# EAGLE design lab2sch (EAGLE 9.6.2)
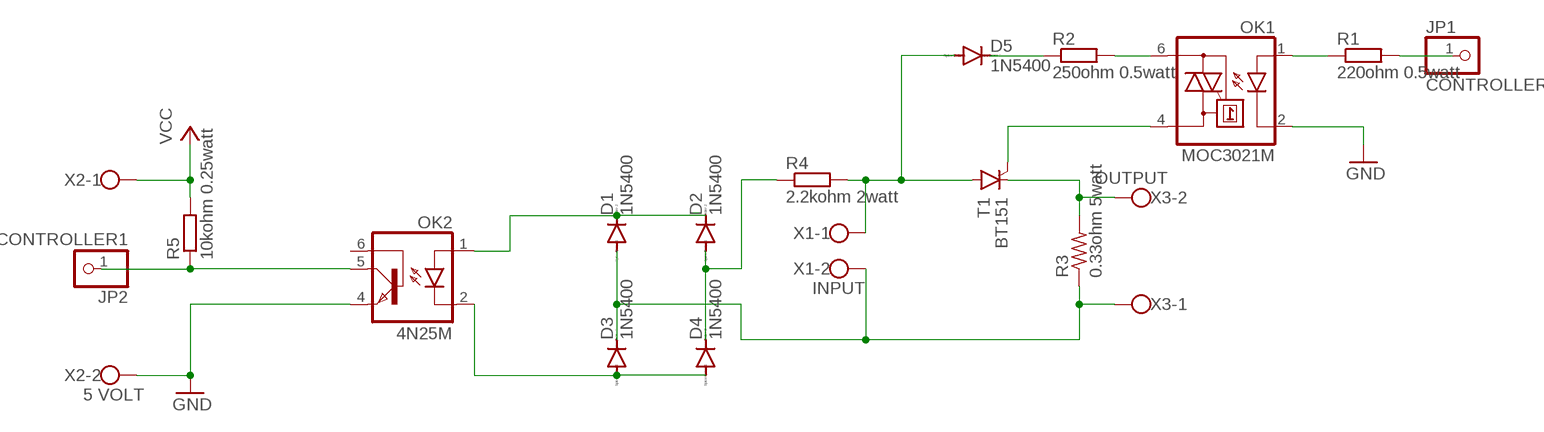
[diagram p0: schematic, sheet 1]

## Parts
D1  1N5400  [DO201-15]
D2  1N5400  [DO201-15]
D3  1N5400  [DO201-15]
D4  1N5400  [DO201-15]
D5  1N5400  [DO201-15]
JP1  CONTROLLER  PINHD-1X1  [1X01]
JP2  CONTROLLER1  PINHD-1X1  [1X01]
OK1  MOC3021M  [DIL06]
OK2  4N25M  [DIL06]
R1  220ohm 0.5watt  R-EU_0204/7  [0204/7]
R2  250ohm 0.5watt  R-EU_0204/7  [0204/7]
R3  0.33ohm 5watt  R-US_0617/22  [0617/22]
R4  2.2kohm 2watt  R-EU_0204/7  [0204/7]
R5  10kohm 0.25watt  R-EU_0204/7  [0204/7]
T1  BT151  [TO220CL]
X1  INPUT  W237-102  [W237-102]
X2  5 VOLT  W237-102  [W237-102]
X3  OUTPUT  W237-102  [W237-102]

## Nets
GND: OK1.2(C) OK2.4(EMI) X2.2
N$1: OK1.1(A) R1.1
N$2: OK1.6(A2) R2.2
N$3: D5.C R2.1
N$4: OK1.4(A1) T1.G
N$5: R3.2 T1.C X3.2
N$6: D5.A R4.2 T1.A X1.1
N$7: D1.C D2.C OK2.1(A)
N$8: D1.A D3.C R3.1 X1.2 X3.1
N$9: D2.A D4.C R4.1
N$10: D3.A D4.A OK2.2(C)
N$11: JP1.1 R1.2
N$13: JP2.1 OK2.5(COL) R5.1
VCC: R5.2 X2.1
Unconnected: OK2.6(BAS)

## Library data of the parts
D1-D5 = diode:1N5400: DIODE standard rectifier, 3 A, 50 V (Motorola)
JP1 JP2 = pinhead:PINHD-1X1: PIN HEADER
OK1 = optocoupler:MOC30*M: RANDOM-PHASE OPTOISOLATORS TRIAC DRIVER OUTPUT Source: http://www.fairchildsemi.com MOC3020-M.pdf; MF: FAIRCHILD SEMICONDUCTOR; MPN: MOC3021-M; OC_FARNELL: 1021365; OC_NEWARK: 95B7895
OK2 = optocoupler:4N*?M: General Purpose 6-Pin Phototransistor Optocouplers Source: http://www.fairchildsemi.com/ds/4N/4N35-M.pdf; MPN: 4N25-M; OC_FARNELL: 1021349; OC_NEWARK: 98K9084
R1 R2 R4 R5 = rcl:R-EU_: RESISTOR, European symbol; SPICEPREFIX: R
R3 = rcl:R-US_: RESISTOR, American symbol; SPICEPREFIX: R
T1 = triac:BT151: THYRISTOR
X1-X3 = con-wago-500:W237-102: WAGO SCREW CLAMP; MPN: 237-102; OC_FARNELL: unknown; OC_NEWARK: 70K9898

## Board
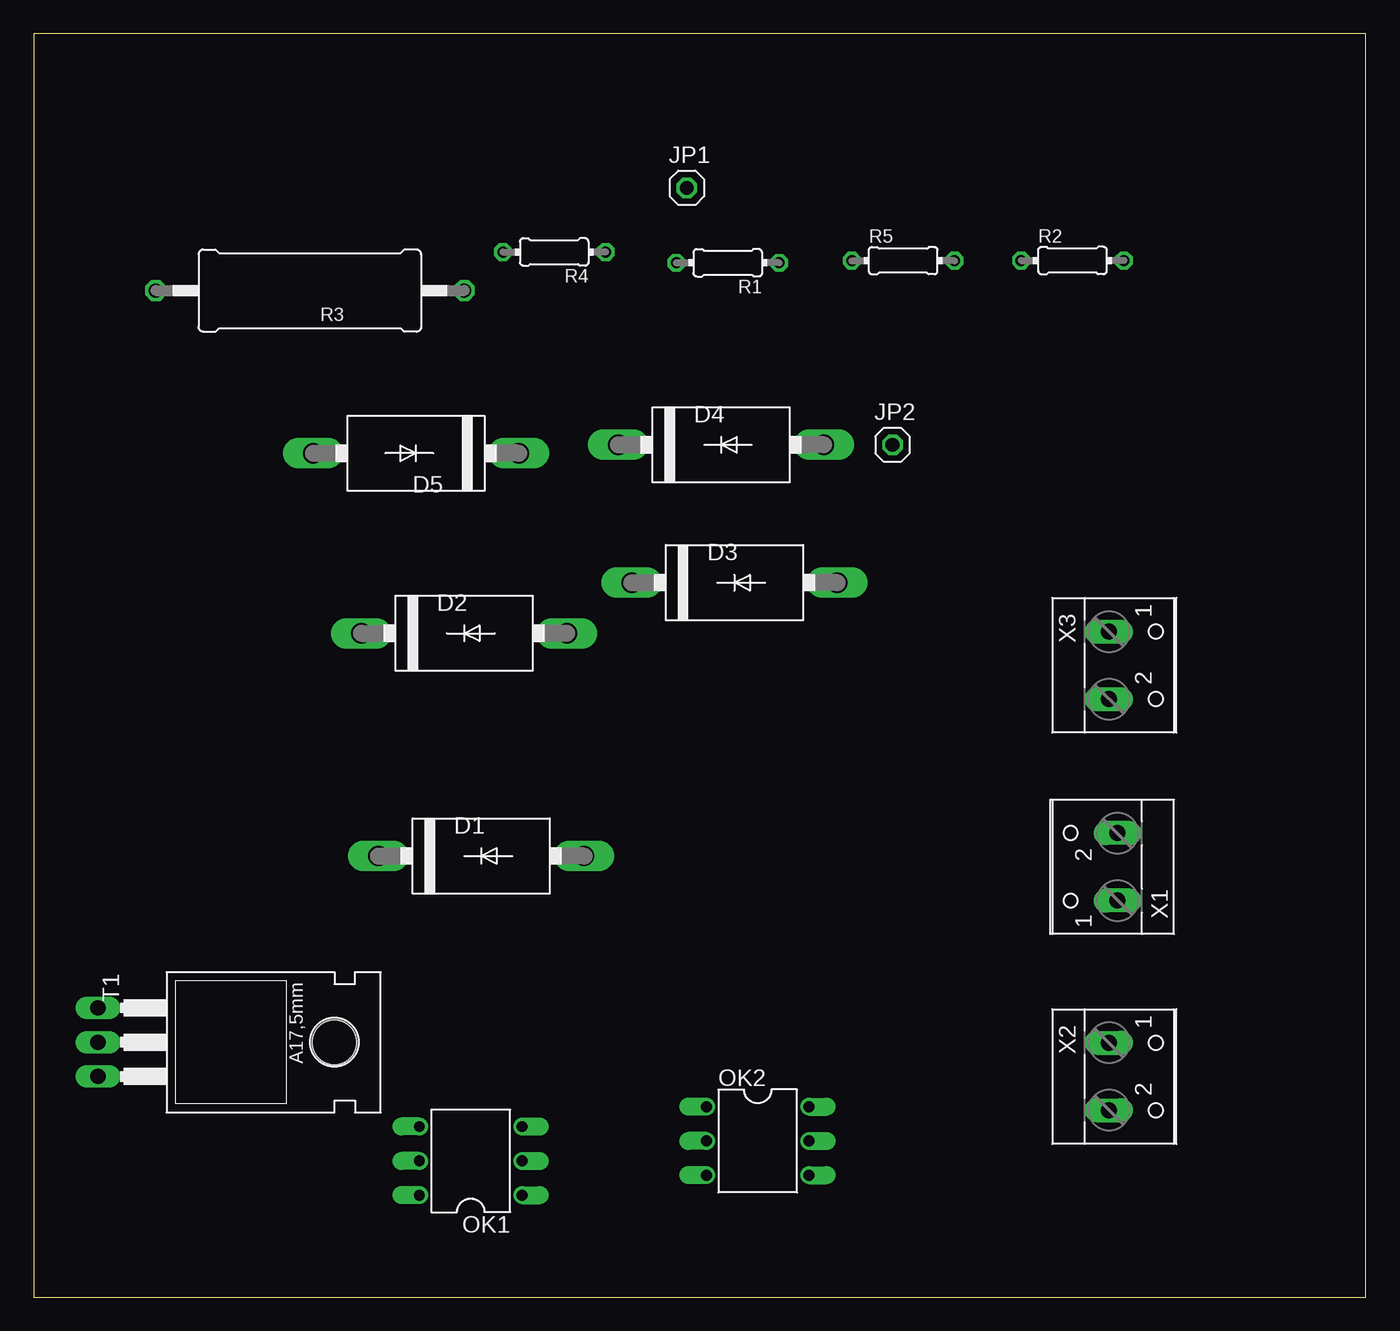
[diagram p1: board, top side]
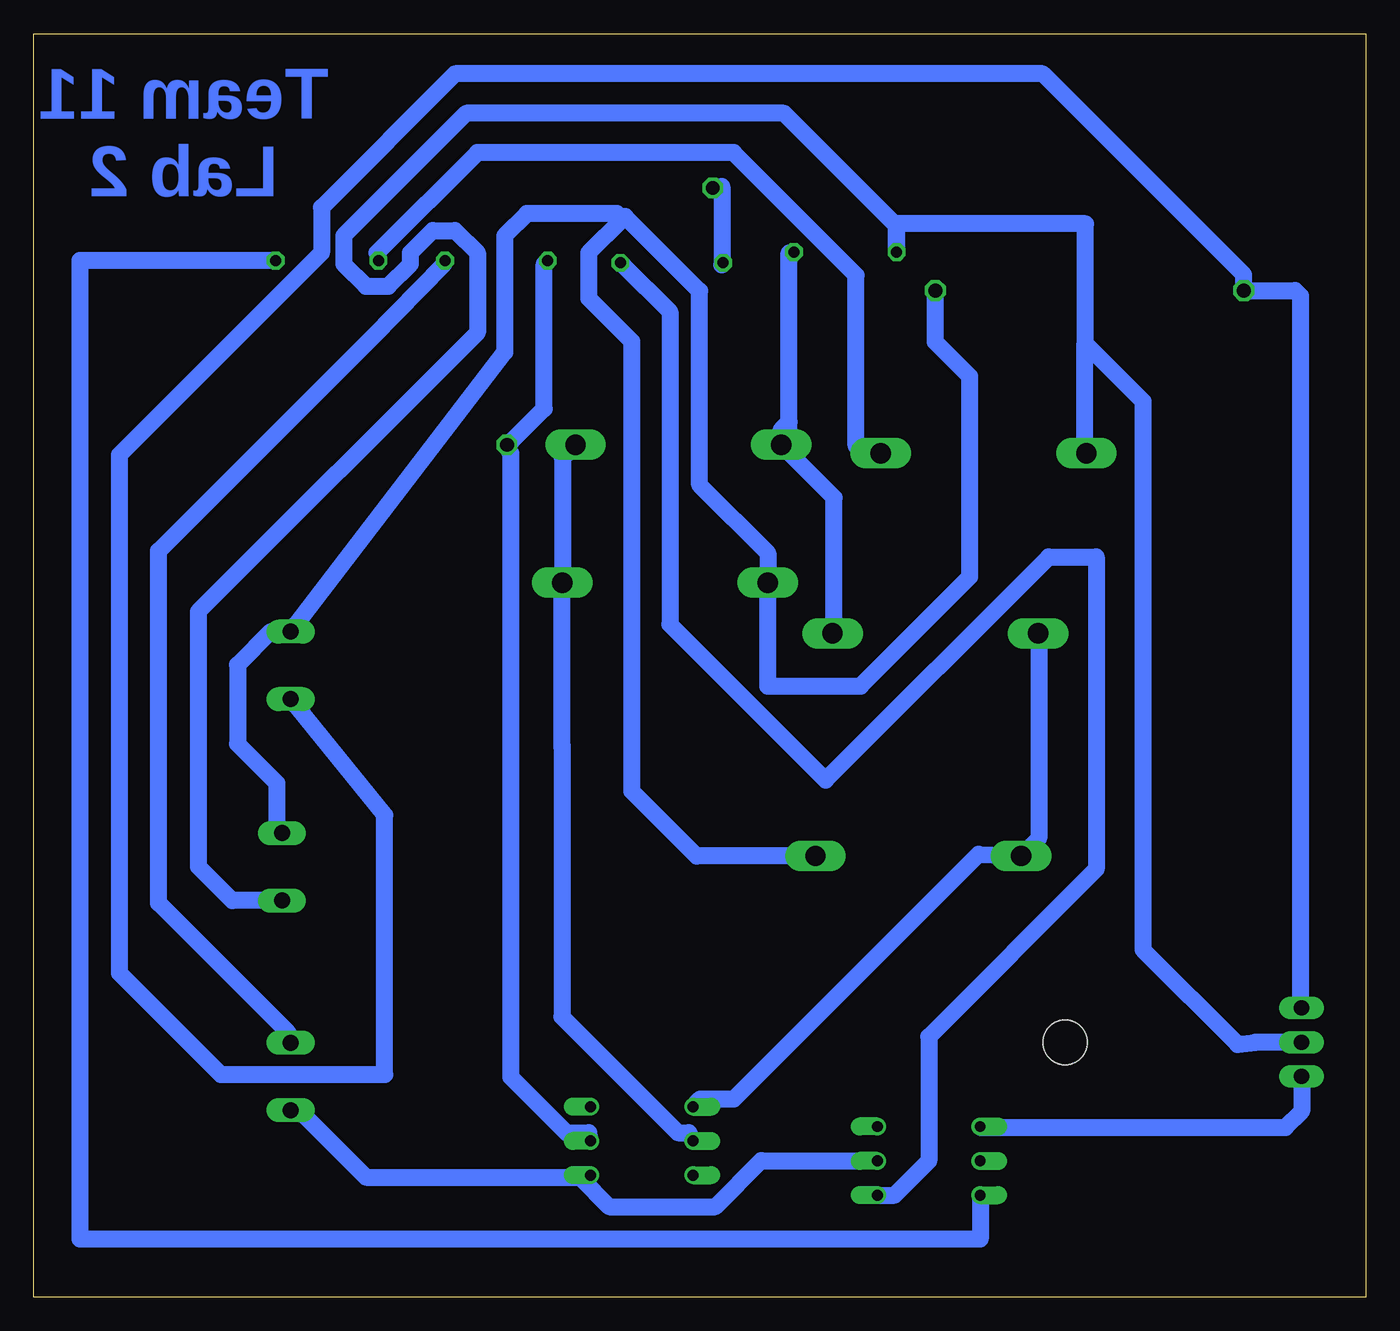
[diagram p2: board, bottom side, seen from below]

Size 98.73 x 93.65 mm. Coordinates in mm from the lower left corner, seen from the top.
Outline: 0,0 98.73,0 98.73,93.65 0,93.65 0,0
Copper layers (1*16): Top 0.035mm / dielectric 1.5mm / Bottom 0.035mm
Design rules "default *": minimum track width 50mil, minimum drill 0.35mm, track to track 15mil, track to pad 6mil, pad to pad 6mil, via to via 6mil, smd to smd 6mil, copper to edge 40mil, drill to drill 6mil, minimum pad ring 10mil, minimum via ring 8mil, stop-mask expansion 4mil, vias tented up to drill 0mil, thermal gap 10mil

### Footprints (pad centres in the part's own frame; a part is rotated, then mirrored left to right if it is on the bottom)
DO201-15 = drill 1.499 long: A 7.62,0; C -7.62,0
1X01 = drill 1.016 octagon: 1 0,0
DIL06 = drill 0.813 offset: 1 -2.54,-3.81; 2 0,-3.81; 3 2.54,-3.81; 4 2.54,3.81; 5 0,3.81; 6 -2.54,3.81
0204/7 = drill 0.813 octagon: 1 -3.81,0; 2 3.81,0
0617/22 = drill 1.016 octagon: 1 -11.43,0; 2 11.43,0
TO220CL = drill 1.118 long: A 0,-6.35; C -2.54,-6.35; G 2.54,-6.35 | hole 3.302: 0,11.176
W237-102 = drill 1.194 long: 1 -2.5,-1.27; 2 2.5,-1.27

### Placement (x,y rotation side)
D1  33.17,32.7 0 top
D2  31.9,49.21 0 top
D3  51.94,52.96 0 top
D4  50.95,63.18 0 top
D5  28.33,62.55 180 top
JP1  48.41,82.23 0 top
JP2  63.65,63.18 0 top
OK1  32.39,10.11 90 top
OK2  53.66,11.58 270 top
R1  51.44,76.67 180 top
R2  76.99,76.84 0 top
R3  20.47,74.61 180 top
R4  38.58,77.47 180 top
R5  64.44,76.83 0 top
T1  11.11,18.9 270 top
X1  79.06,31.9 90 top
X2  80.96,16.36 270 top
X3  80.96,46.84 270 top

### Tracks (layer width: path | path; a pad name or v marks a point on that pad's centre or on a via)
GND
  Bottom 1.27: 58.25,8.89 74.11,8.89 79.06,13.84 X2.2 | 58.25,8.89 57.59,8.89 OK2.4 | 58.25,8.89 56.07,6.72 48.21,6.72 44.79,10.13 44.63,10.11 OK1.2
N$1
  Bottom 1.27: OK1.1 34.93,7.57 32.39,10.11 32.39,19.31 19.97,31.73 19.97,54.87 23.5,54.87 40.04,38.33 51.59,49.87 51.59,73.05 55.12,76.58 R1.1
N$2
  Bottom 1.27: OK1.6 28.58,4.32 95.31,4.32 95.31,76.84 R2.2
N$3
  Bottom 1.27: R2.1 73.28,77.41 65.85,84.84 46.86,84.84 37.78,75.75 37.78,63.11 D5.C
N$4
  Bottom 1.27: OK1.4 28.51,12.58 5.96,12.58 4.76,13.78 T1.G
N$5
  Bottom 1.27: T1.C 4.84,21.44 4.84,74.22 5.23,74.61 R3.2 9.04,75.78 23.94,90.68 67.5,90.68 77.41,80.77 77.41,77.41 92.39,62.42 92.39,24.04 84.87,16.51 72.71,16.51 72.71,35.74 X3.2
N$6
  Bottom 1.27: 20.81,70.14 20.81,62.48 20.79,62.48 D5.A | 20.81,70.14 20.81,70.72 16.51,66.42 16.51,25.75 9.49,18.73 8.15,18.9 T1.A | 20.81,70.14 20.78,70.12 20.78,79.56 34.77,79.56 R4.2 34.77,79.41 43.12,87.76 66.67,87.76 75.75,78.68 75.75,76.58 74.11,74.93 72.45,74.93 70.8,76.58 70.8,77.41 69.15,79.06 67.5,79.06 65.85,77.41 65.85,71.5 86.53,50.82 86.53,31.92 84.01,29.4 X1.1
N$7
  Bottom 1.27: OK2.1 49.34,14.67 46.86,14.67 28.7,32.83 D1.C 24.24,34.01 24.24,49.17 D2.C
N$8
  Bottom 1.27: X1.2 80.71,34.48 80.71,38.1 83.63,41.02 83.63,46.86 81.16,49.34 X3.1 63.82,70.04 63.82,78.68 62.17,80.33 55.5,80.33 55.09,79.92 | R3.1 31.9,70.8 29.36,68.26 29.36,53.38 37.45,45.3 44.32,45.3 D3.C 44.32,55.15 49.38,60.21 49.38,74.59 54.9,80.11 55.09,79.92 | D1.A 49.59,32.7 54.4,37.51 54.4,70.85 57.59,74.04 57.59,77.41 55.09,79.92
N$9
  Bottom 1.27: 42.74,63.81 42.74,64.9 | 42.74,64.9 42.74,77.41 R4.1 | D2.A 39.41,49.22 39.41,59.26 D4.C 43.33,64.3 42.74,64.9
N$10
  Bottom 1.27: OK2.2 50.16,12.19 50.99,12.19 59.59,20.79 59.59,40.75 59.56,40.86 D3.A 59.54,52.96 59.54,62.21 D4.A
N$11
  Bottom 1.27: R1.2 47.73,76.52 47.73,82.32 48.21,82.23 JP1.1
N$13
  Bottom 1.27: OK2.5 57.59,12.19 59.24,12.19 63.37,16.32 63.37,62.55 JP2.1 63.37,63.37 60.9,65.85 60.9,76.58 R5.1
VCC
  Bottom 1.27: R5.2 68.33,76.58 73.66,71.12 89.47,55.31 89.47,29.21 79.88,19.62 X2.1

### Text on the board
Bottom: Team 11 / Lab 2